# Altium schematic sheet AudioInputs_16.SchDoc
size Tabloid; DocumentNumber: 10; SheetNumber: 10; SheetTotal: 11; SheetName: Analog input (group); Size: 11x17; Sheet_Name: AudiInputs_16
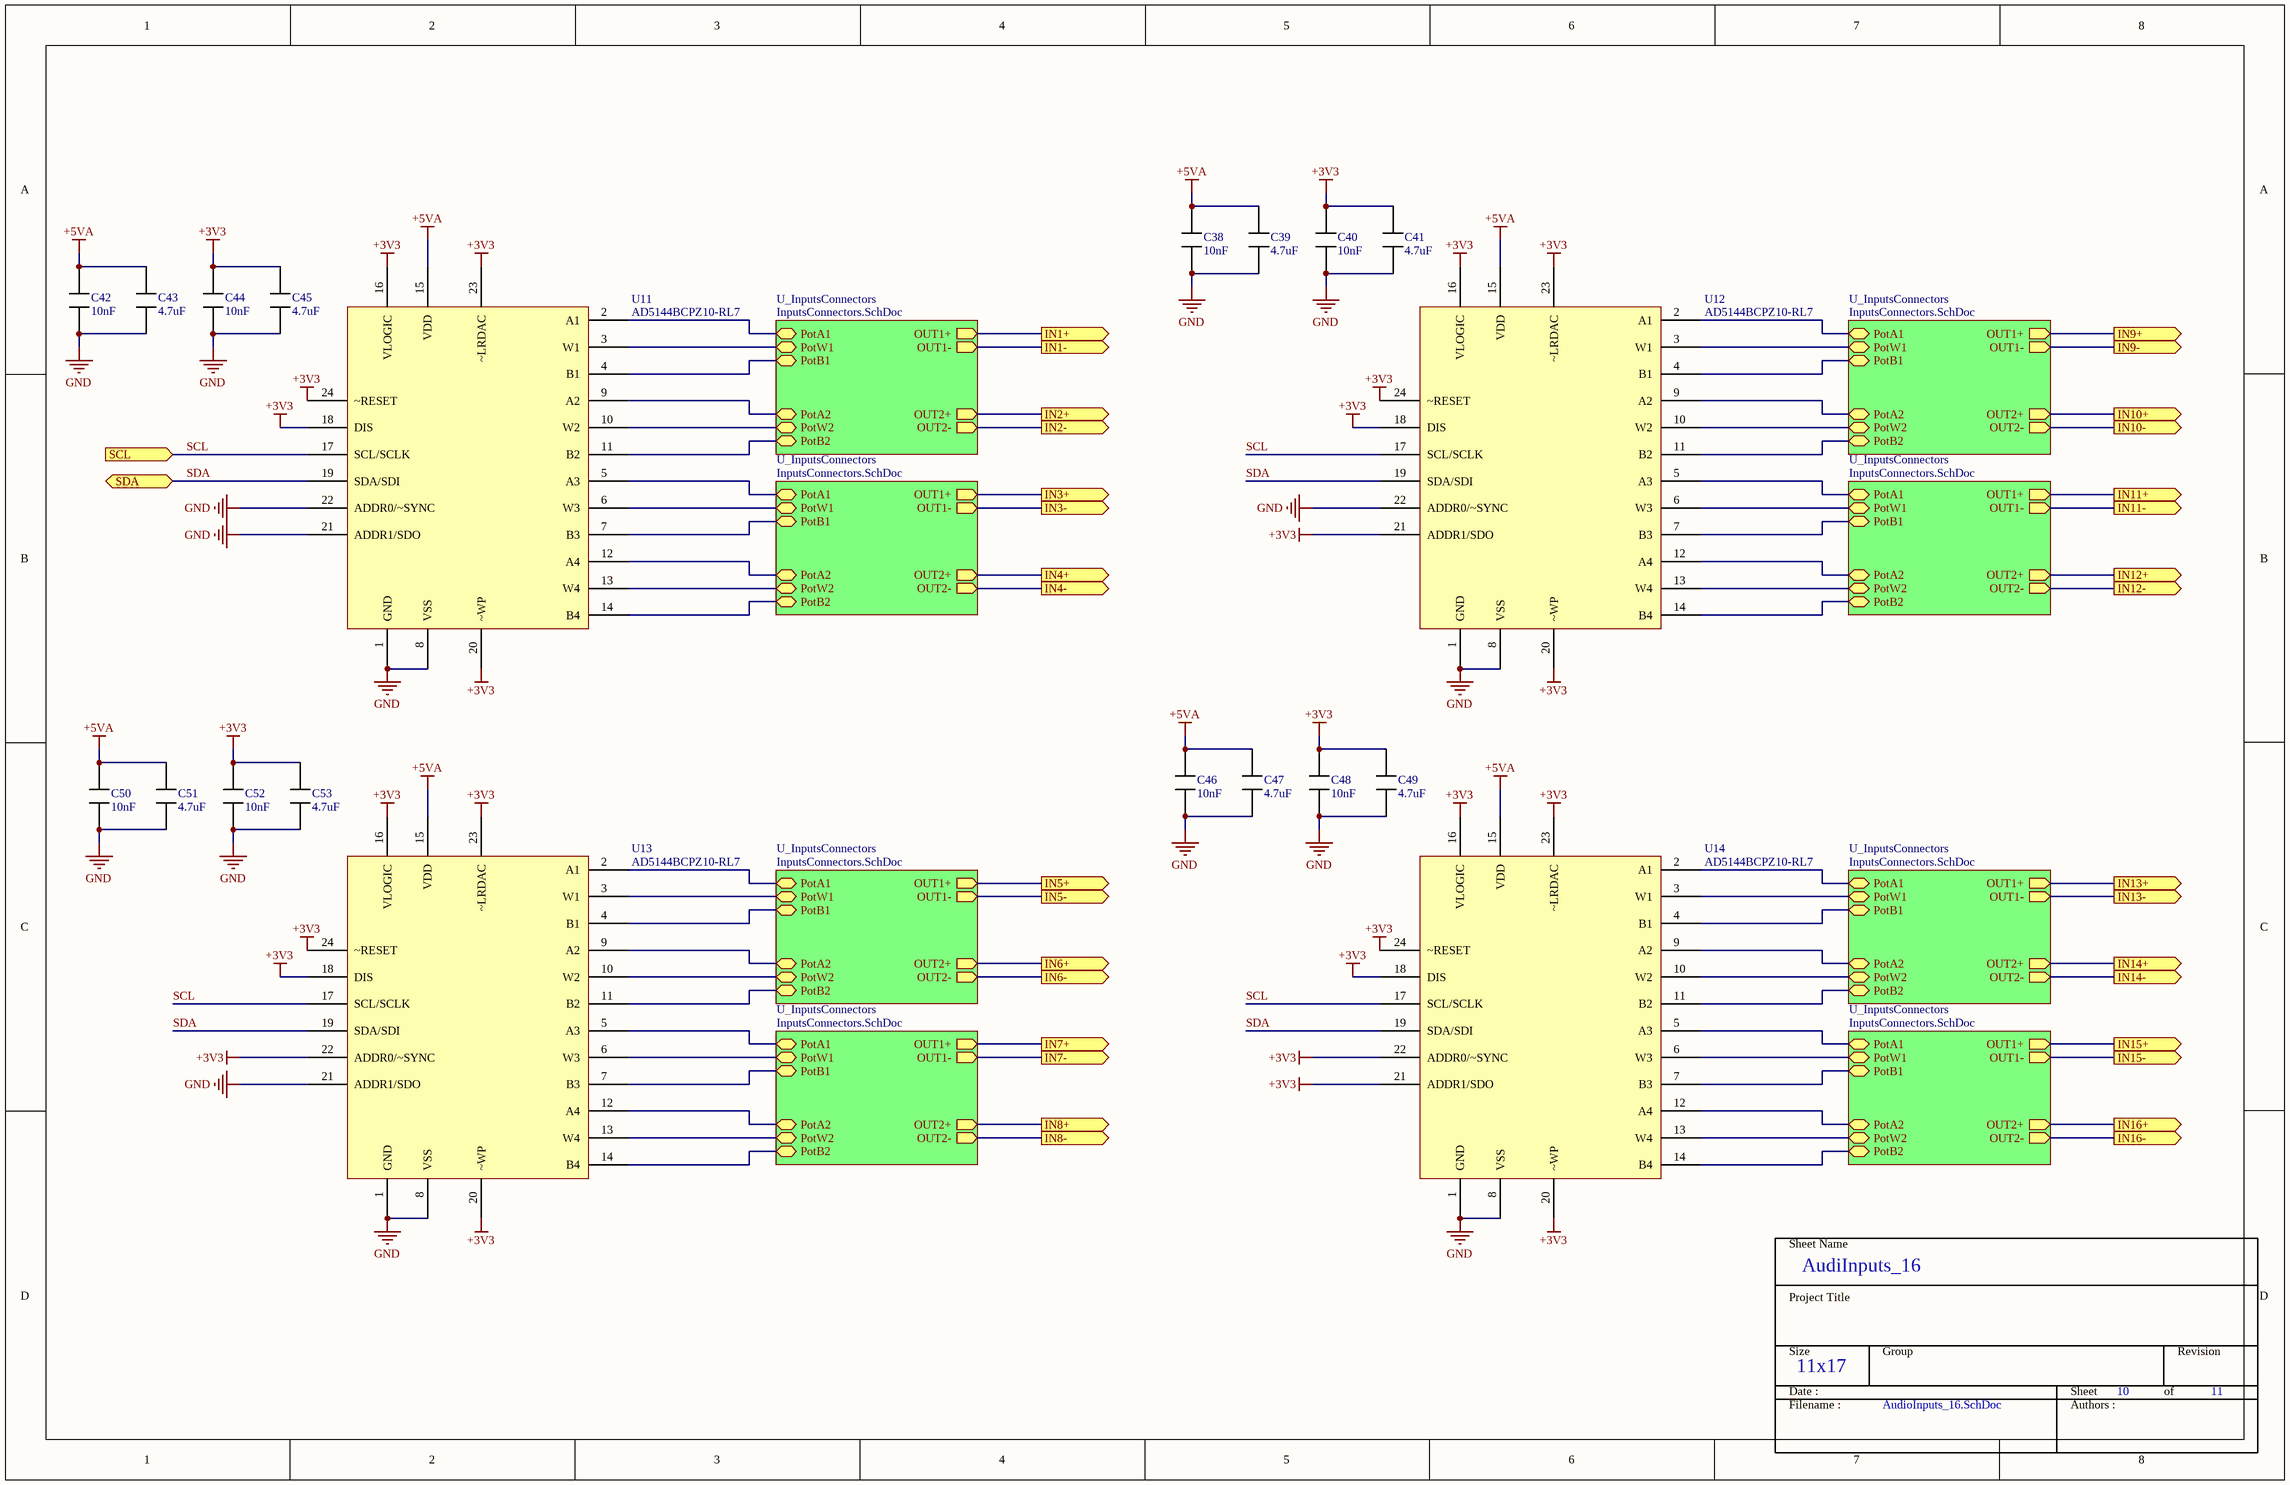
[diagram p0: AudioInputs_16.SchDoc]

## Parts
C38  value 10nF  [0402]  (hidden comment: Capacitor)
C39  value 4.7uF  [0402]  (hidden comment: Capacitor)
C40  value 10nF  [0402]  (hidden comment: Capacitor)
C41  value 4.7uF  [0402]  (hidden comment: Capacitor)
C42  value 10nF  [0402]  (hidden comment: Capacitor)
C43  value 4.7uF  [0402]  (hidden comment: Capacitor)
C44  value 10nF  [0402]  (hidden comment: Capacitor)
C45  value 4.7uF  [0402]  (hidden comment: Capacitor)
C46  value 10nF  [0402]  (hidden comment: Capacitor)
C47  value 4.7uF  [0402]  (hidden comment: Capacitor)
C48  value 10nF  [0402]  (hidden comment: Capacitor)
C49  value 4.7uF  [0402]  (hidden comment: Capacitor)
C50  value 10nF  [0402]  (hidden comment: Capacitor)
C51  value 4.7uF  [0402]  (hidden comment: Capacitor)
C52  value 10nF  [0402]  (hidden comment: Capacitor)
C53  value 4.7uF  [0402]  (hidden comment: Capacitor)
U11  AD5144BCPZ10-RL7  [QFN50P400X400X100-25N]
U12  AD5144BCPZ10-RL7  [QFN50P400X400X100-25N]
U13  AD5144BCPZ10-RL7  [QFN50P400X400X100-25N]
U14  AD5144BCPZ10-RL7  [QFN50P400X400X100-25N]

## Sub-sheets
U_InputsConnectors = InputsConnectors.SchDoc: OUT1+ (out), OUT1- (out), OUT2+ (out), OUT2- (out), PotA1 (bidir), PotW1 (bidir), PotB1 (bidir), PotA2 (bidir), PotW2 (bidir), PotB2 (bidir)
U_InputsConnectors = InputsConnectors.SchDoc: OUT1+ (out), OUT1- (out), OUT2+ (out), OUT2- (out), PotA1 (bidir), PotW1 (bidir), PotB1 (bidir), PotA2 (bidir), PotW2 (bidir), PotB2 (bidir)
U_InputsConnectors = InputsConnectors.SchDoc: OUT1+ (out), OUT1- (out), OUT2+ (out), OUT2- (out), PotA1 (bidir), PotW1 (bidir), PotB1 (bidir), PotA2 (bidir), PotW2 (bidir), PotB2 (bidir)
U_InputsConnectors = InputsConnectors.SchDoc: OUT1+ (out), OUT1- (out), OUT2+ (out), OUT2- (out), PotA1 (bidir), PotW1 (bidir), PotB1 (bidir), PotA2 (bidir), PotW2 (bidir), PotB2 (bidir)
U_InputsConnectors = InputsConnectors.SchDoc: OUT1+ (out), OUT1- (out), OUT2+ (out), OUT2- (out), PotA1 (bidir), PotW1 (bidir), PotB1 (bidir), PotA2 (bidir), PotW2 (bidir), PotB2 (bidir)
U_InputsConnectors = InputsConnectors.SchDoc: OUT1+ (out), OUT1- (out), OUT2+ (out), OUT2- (out), PotA1 (bidir), PotW1 (bidir), PotB1 (bidir), PotA2 (bidir), PotW2 (bidir), PotB2 (bidir)
U_InputsConnectors = InputsConnectors.SchDoc: OUT1+ (out), OUT1- (out), OUT2+ (out), OUT2- (out), PotA1 (bidir), PotW1 (bidir), PotB1 (bidir), PotA2 (bidir), PotW2 (bidir), PotB2 (bidir)
U_InputsConnectors = InputsConnectors.SchDoc: OUT1+ (out), OUT1- (out), OUT2+ (out), OUT2- (out), PotA1 (bidir), PotW1 (bidir), PotB1 (bidir), PotA2 (bidir), PotW2 (bidir), PotB2 (bidir)

## Ports
IN1+ (out), IN1- (out), IN2+ (out), IN2- (out), IN3+ (out), IN3- (out), IN4+ (out), IN4- (out), IN5+ (out), IN5- (out), IN6+ (out), IN6- (out), IN7+ (out), IN7- (out), IN8+ (out), IN8- (out), IN9+ (out), IN9- (out), IN10+ (out), IN10- (out), IN11+ (out), IN11- (out), IN12+ (out), IN12- (out), IN13+ (out), IN13- (out), IN14+ (out), IN14- (out), IN15+ (out), IN15- (out), IN16+ (out), IN16- (out), SCL (in), SDA (bidir)

## Nets
+3V3: C40.1 C41.1 C44.1 C45.1 C48.1 C49.1 C52.1 C53.1 U11.16(VLOGIC) U11.18(DIS) U11.20(~WP) U11.23(~LRDAC) U11.24(~RESET) U12.16(VLOGIC) U12.18(DIS) U12.20(~WP) U12.21(ADDR1/SDO) U12.23(~LRDAC) U12.24(~RESET) U13.16(VLOGIC) U13.18(DIS) U13.20(~WP) U13.22(ADDR0/~SYNC) U13.23(~LRDAC) U13.24(~RESET) U14.16(VLOGIC) U14.18(DIS) U14.20(~WP) U14.21(ADDR1/SDO) U14.22(ADDR0/~SYNC) U14.23(~LRDAC) U14.24(~RESET)
+5VA: C38.1 C39.1 C42.1 C43.1 C46.1 C47.1 C50.1 C51.1 U11.15(VDD) U12.15(VDD) U13.15(VDD) U14.15(VDD)
GND: C38.2 C39.2 C40.2 C41.2 C42.2 C43.2 C44.2 C45.2 C46.2 C47.2 C48.2 C49.2 C50.2 C51.2 C52.2 C53.2 U11.1(GND) U11.8(VSS) U11.21(ADDR1/SDO) U11.22(ADDR0/~SYNC) U12.1(GND) U12.8(VSS) U12.22(ADDR0/~SYNC) U13.1(GND) U13.8(VSS) U13.21(ADDR1/SDO) U14.1(GND) U14.8(VSS)
IN1+: port IN1+, sheet U_InputsConnectors/OUT1+
IN1-: port IN1-, sheet U_InputsConnectors/OUT1-
IN2+: port IN2+, sheet U_InputsConnectors/OUT2+
IN2-: port IN2-, sheet U_InputsConnectors/OUT2-
IN3+: port IN3+, sheet U_InputsConnectors/OUT1+
IN3-: port IN3-, sheet U_InputsConnectors/OUT1-
IN4+: port IN4+, sheet U_InputsConnectors/OUT2+
IN4-: port IN4-, sheet U_InputsConnectors/OUT2-
IN5+: port IN5+, sheet U_InputsConnectors/OUT1+
IN5-: port IN5-, sheet U_InputsConnectors/OUT1-
IN6+: port IN6+, sheet U_InputsConnectors/OUT2+
IN6-: port IN6-, sheet U_InputsConnectors/OUT2-
IN7+: port IN7+, sheet U_InputsConnectors/OUT1+
IN7-: port IN7-, sheet U_InputsConnectors/OUT1-
IN8+: port IN8+, sheet U_InputsConnectors/OUT2+
IN8-: port IN8-, sheet U_InputsConnectors/OUT2-
IN9+: port IN9+, sheet U_InputsConnectors/OUT1+
IN9-: port IN9-, sheet U_InputsConnectors/OUT1-
IN10+: port IN10+, sheet U_InputsConnectors/OUT2+
IN10-: port IN10-, sheet U_InputsConnectors/OUT2-
IN11+: port IN11+, sheet U_InputsConnectors/OUT1+
IN11-: port IN11-, sheet U_InputsConnectors/OUT1-
IN12+: port IN12+, sheet U_InputsConnectors/OUT2+
IN12-: port IN12-, sheet U_InputsConnectors/OUT2-
IN13+: port IN13+, sheet U_InputsConnectors/OUT1+
IN13-: port IN13-, sheet U_InputsConnectors/OUT1-
IN14+: port IN14+, sheet U_InputsConnectors/OUT2+
IN14-: port IN14-, sheet U_InputsConnectors/OUT2-
IN15+: port IN15+, sheet U_InputsConnectors/OUT1+
IN15-: port IN15-, sheet U_InputsConnectors/OUT1-
IN16+: port IN16+, sheet U_InputsConnectors/OUT2+
IN16-: port IN16-, sheet U_InputsConnectors/OUT2-
SCL: U11.17(SCL/SCLK) U12.17(SCL/SCLK) U13.17(SCL/SCLK) U14.17(SCL/SCLK) ; port SCL
SDA: U11.19(SDA/SDI) U12.19(SDA/SDI) U13.19(SDA/SDI) U14.19(SDA/SDI) ; port SDA
NetU11_2: U11.2(A1) ; sheet U_InputsConnectors/PotA1
NetU11_3: U11.3(W1) ; sheet U_InputsConnectors/PotW1
NetU11_4: U11.4(B1) ; sheet U_InputsConnectors/PotB1
NetU11_5: U11.5(A3) ; sheet U_InputsConnectors/PotA1
NetU11_6: U11.6(W3) ; sheet U_InputsConnectors/PotW1
NetU11_7: U11.7(B3) ; sheet U_InputsConnectors/PotB1
NetU11_9: U11.9(A2) ; sheet U_InputsConnectors/PotA2
NetU11_10: U11.10(W2) ; sheet U_InputsConnectors/PotW2
NetU11_11: U11.11(B2) ; sheet U_InputsConnectors/PotB2
NetU11_12: U11.12(A4) ; sheet U_InputsConnectors/PotA2
NetU11_13: U11.13(W4) ; sheet U_InputsConnectors/PotW2
NetU11_14: U11.14(B4) ; sheet U_InputsConnectors/PotB2
NetU12_2: U12.2(A1) ; sheet U_InputsConnectors/PotA1
NetU12_3: U12.3(W1) ; sheet U_InputsConnectors/PotW1
NetU12_4: U12.4(B1) ; sheet U_InputsConnectors/PotB1
NetU12_5: U12.5(A3) ; sheet U_InputsConnectors/PotA1
NetU12_6: U12.6(W3) ; sheet U_InputsConnectors/PotW1
NetU12_7: U12.7(B3) ; sheet U_InputsConnectors/PotB1
NetU12_9: U12.9(A2) ; sheet U_InputsConnectors/PotA2
NetU12_10: U12.10(W2) ; sheet U_InputsConnectors/PotW2
NetU12_11: U12.11(B2) ; sheet U_InputsConnectors/PotB2
NetU12_12: U12.12(A4) ; sheet U_InputsConnectors/PotA2
NetU12_13: U12.13(W4) ; sheet U_InputsConnectors/PotW2
NetU12_14: U12.14(B4) ; sheet U_InputsConnectors/PotB2
NetU13_2: U13.2(A1) ; sheet U_InputsConnectors/PotA1
NetU13_3: U13.3(W1) ; sheet U_InputsConnectors/PotW1
NetU13_4: U13.4(B1) ; sheet U_InputsConnectors/PotB1
NetU13_5: U13.5(A3) ; sheet U_InputsConnectors/PotA1
NetU13_6: U13.6(W3) ; sheet U_InputsConnectors/PotW1
NetU13_7: U13.7(B3) ; sheet U_InputsConnectors/PotB1
NetU13_9: U13.9(A2) ; sheet U_InputsConnectors/PotA2
NetU13_10: U13.10(W2) ; sheet U_InputsConnectors/PotW2
NetU13_11: U13.11(B2) ; sheet U_InputsConnectors/PotB2
NetU13_12: U13.12(A4) ; sheet U_InputsConnectors/PotA2
NetU13_13: U13.13(W4) ; sheet U_InputsConnectors/PotW2
NetU13_14: U13.14(B4) ; sheet U_InputsConnectors/PotB2
NetU14_2: U14.2(A1) ; sheet U_InputsConnectors/PotA1
NetU14_3: U14.3(W1) ; sheet U_InputsConnectors/PotW1
NetU14_4: U14.4(B1) ; sheet U_InputsConnectors/PotB1
NetU14_5: U14.5(A3) ; sheet U_InputsConnectors/PotA1
NetU14_6: U14.6(W3) ; sheet U_InputsConnectors/PotW1
NetU14_7: U14.7(B3) ; sheet U_InputsConnectors/PotB1
NetU14_9: U14.9(A2) ; sheet U_InputsConnectors/PotA2
NetU14_10: U14.10(W2) ; sheet U_InputsConnectors/PotW2
NetU14_11: U14.11(B2) ; sheet U_InputsConnectors/PotB2
NetU14_12: U14.12(A4) ; sheet U_InputsConnectors/PotA2
NetU14_13: U14.13(W4) ; sheet U_InputsConnectors/PotW2
NetU14_14: U14.14(B4) ; sheet U_InputsConnectors/PotB2

## Notes on the sheet
- Sheet Name
- Project Title
- Size
- Group
- Revision
- Date :
- Filename :
- Sheet
- Authors :
- of

## Library data of the parts
C38 C40 C42 C44 C46 C48 C50 C52 = Capacitor: Mfg: Samsung; Mfg_PN: CL05B103KO5NNNC; HelpURL: *; NI: *; Supplier1: Digikey; Supplier1_PN: 1276-1051-1-ND; Tolerance: *; Type: *; Rating: *
C39 C41 C43 C45 C47 C49 C51 C53 = Capacitor: Mfg: Samsung; Mfg_PN: CL05A475MP5NRNC; HelpURL: *; NI: *; Supplier1: Digikey; Supplier1_PN: 1276-1482-1-ND; Tolerance: *; Type: *; Rating: *
U11-U14 = AD5144BCPZ10-RL7: Mfg: Analog Devices Inc.; Mfg_PN: AD5144BCPZ10-RL7; Supplier1: Digikey; Supplier1_PN: AD5144BCPZ10-RL7DKR-ND